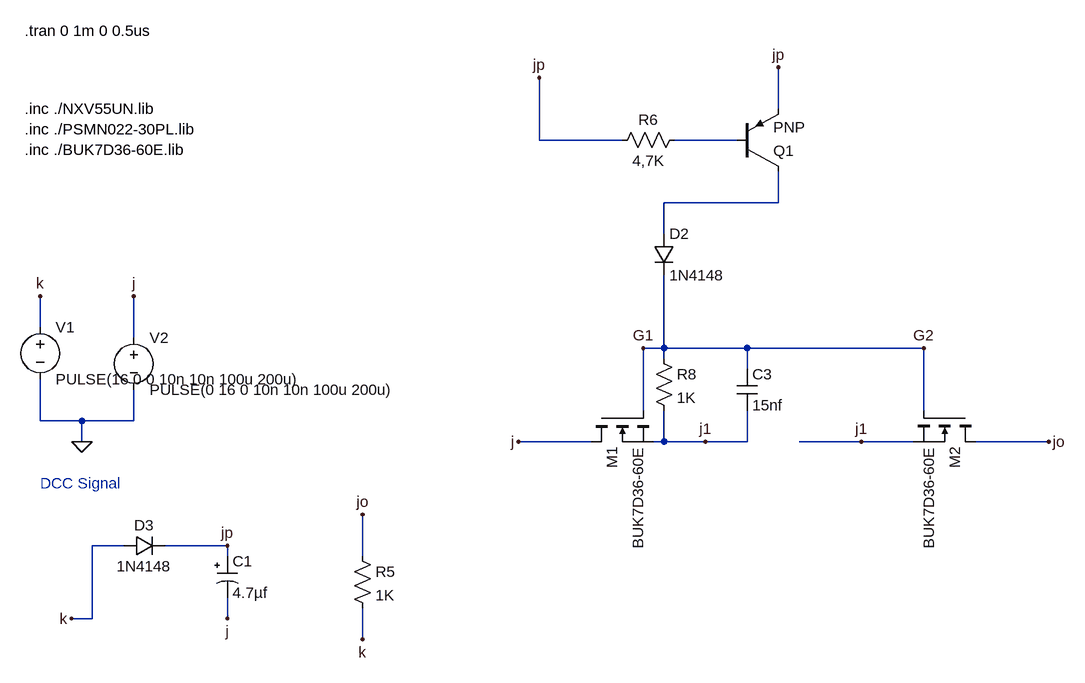
[diagram p0: schematic V5_dccAbc-buk.asc]
V5_dccAbc-buk.asc, the LTspice schematic file:
Version 4
SHEET 1 1012 680
WIRE -720 -1024 -720 -1088
WIRE -1088 -976 -1088 -1072
WIRE -960 -976 -1088 -976
WIRE -784 -976 -880 -976
WIRE -720 -880 -720 -928
WIRE -720 -880 -896 -880
WIRE -896 -832 -896 -880
WIRE -1856 -688 -1856 -736
WIRE -1712 -672 -1712 -736
WIRE -896 -656 -896 -768
WIRE -896 -656 -928 -656
WIRE -768 -656 -896 -656
WIRE -496 -656 -768 -656
WIRE -896 -640 -896 -656
WIRE -768 -624 -768 -656
WIRE -928 -560 -928 -656
WIRE -496 -560 -496 -656
WIRE -1856 -544 -1856 -608
WIRE -1792 -544 -1856 -544
WIRE -1712 -544 -1712 -592
WIRE -1712 -544 -1792 -544
WIRE -1792 -512 -1792 -544
WIRE -1008 -512 -1120 -512
WIRE -896 -512 -896 -560
WIRE -896 -512 -912 -512
WIRE -832 -512 -896 -512
WIRE -768 -512 -768 -560
WIRE -768 -512 -832 -512
WIRE -592 -512 -688 -512
WIRE -512 -512 -592 -512
WIRE -304 -512 -416 -512
WIRE -1728 -352 -1776 -352
WIRE -1568 -352 -1664 -352
WIRE -1568 -336 -1568 -352
WIRE -1360 -336 -1360 -400
WIRE -1776 -240 -1776 -352
WIRE -1776 -240 -1808 -240
WIRE -1568 -240 -1568 -272
WIRE -1360 -208 -1360 -256
FLAG -1792 -512 0
FLAG -1712 -736 j
FLAG -1856 -736 k
FLAG -1120 -512 j
FLAG -832 -512 j1
FLAG -304 -512 jo
FLAG -1360 -400 jo
FLAG -1360 -208 k
FLAG -1808 -240 k
FLAG -1568 -240 j
FLAG -1568 -352 jp
FLAG -592 -512 j1
FLAG -720 -1088 jp
FLAG -1088 -1072 jp
FLAG -928 -656 G1
FLAG -496 -656 G2
SYMBOL voltage -1712 -688 R0
SYMATTR InstName V2
SYMATTR Value PULSE(0 16 0 10n 10n 100u 200u)
SYMBOL voltage -1856 -704 R0
SYMATTR InstName V1
SYMATTR Value PULSE(16 0 0 10n 10n 100u 200u)
SYMBOL nmos -1008 -560 M90
SYMATTR InstName M1
SYMATTR Value BUK7D36-60E
SYMATTR Prefix X
SYMBOL nmos -416 -560 R90
SYMATTR InstName M2
SYMATTR Value BUK7D36-60E
SYMATTR Prefix X
SYMBOL res -1376 -352 R0
SYMATTR InstName R5
SYMATTR Value 1K
SYMBOL polcap -1584 -336 R0
SYMATTR InstName C1
SYMATTR Value 4.7µf
SYMBOL diode -1728 -336 R270
WINDOW 0 32 32 VTop 2
WINDOW 3 0 32 VBottom 2
SYMATTR InstName D3
SYMATTR Value 1N4148
SYMBOL pnp -784 -928 M180
SYMATTR InstName Q1
SYMBOL res -864 -992 R90
WINDOW 0 0 56 VBottom 2
WINDOW 3 32 56 VTop 2
SYMATTR InstName R6
SYMATTR Value 4,7K
SYMBOL diode -912 -832 R0
SYMATTR InstName D2
SYMATTR Value 1N4148
SYMBOL res -912 -656 R0
SYMATTR InstName R8
SYMATTR Value 1K
SYMBOL cap -784 -624 R0
SYMATTR InstName C3
SYMATTR Value 15nf
TEXT -1880 -1144 Left 2 !.tran 0 1m 0 0.5us
TEXT -1856 -448 Left 2 ;DCC Signal
TEXT -1880 -1024 Left 2 !.inc ./NXV55UN.lib\n.inc ./PSMN022-30PL.lib\n.inc ./BUK7D36-60E.lib

The netlist it stands for:
* V5_dccAbc-buk.asc
V2 j 0 PULSE(0 16 0 10n 10n 100u 200u)
V1 k 0 PULSE(16 0 0 10n 10n 100u 200u)
XM1 j G2 j1 BUK7D36-60E  ; pins D G S
XM2 jo G2 j1 BUK7D36-60E  ; pins D G S
R5 jo k 1K
C1 jp j 4.7µf
D3 k jp 1N4148
Q1 N002 N001 jp 0 PNP
R6 N001 jp 4,7K
D2 N002 G2 1N4148
R8 G2 j1 1K
C3 G2 j1 15nf
.model D D
.lib standard.dio
.model NPN NPN
.model PNP PNP
.lib standard.bjt
.tran 0 1m 0 0.5us
* DCC Signal
.inc ./NXV55UN.lib
.inc ./PSMN022-30PL.lib
.inc ./BUK7D36-60E.lib
.backanno
.end